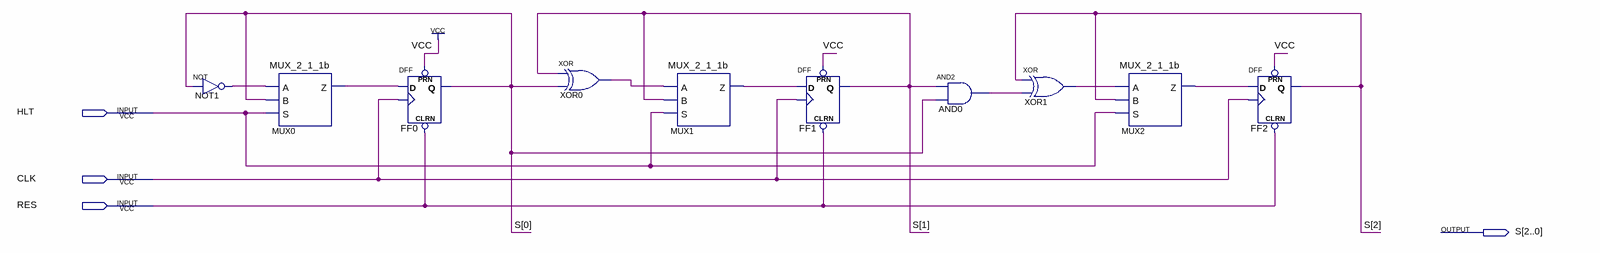
[diagram p0: schematic sheet]
// Quartus schematic CONT_3b.bdf as structural Verilog: 10 symbols, 4 pins
module CONT_3b (
  input  HLT,
  input  CLK,
  input  RES,
  output [2:0] S
);

  wire AND0_out, MUX0_z, MUX1_z, MUX2_z, NOT1_out, XOR0_out, XOR1_out;

  not NOT1 (NOT1_out, S[0]);
  MUX_2_1_1b MUX0 (.A(NOT1_out), .B(S[0]), .S(HLT), .Z(MUX0_z));
  DFF FF0 (.CLRN(RES), .CLK(CLK), .D(MUX0_z), .PRN(1'b1), .Q(S[0]));
  xor XOR0 (XOR0_out, S[1], S[0]);
  MUX_2_1_1b MUX1 (.A(XOR0_out), .B(S[1]), .S(HLT), .Z(MUX1_z));
  DFF FF1 (.CLRN(RES), .CLK(CLK), .D(MUX1_z), .PRN(1'b1), .Q(S[1]));
  and AND0 (AND0_out, S[1], S[0]);
  xor XOR1 (XOR1_out, S[2], AND0_out);
  MUX_2_1_1b MUX2 (.A(XOR1_out), .B(S[2]), .S(HLT), .Z(MUX2_z));
  DFF FF2 (.CLRN(RES), .CLK(CLK), .D(MUX2_z), .PRN(1'b1), .Q(S[2]));
endmodule
